# EAGLE design Adafruit Motor Shield v2.3 (EAGLE 6.4)
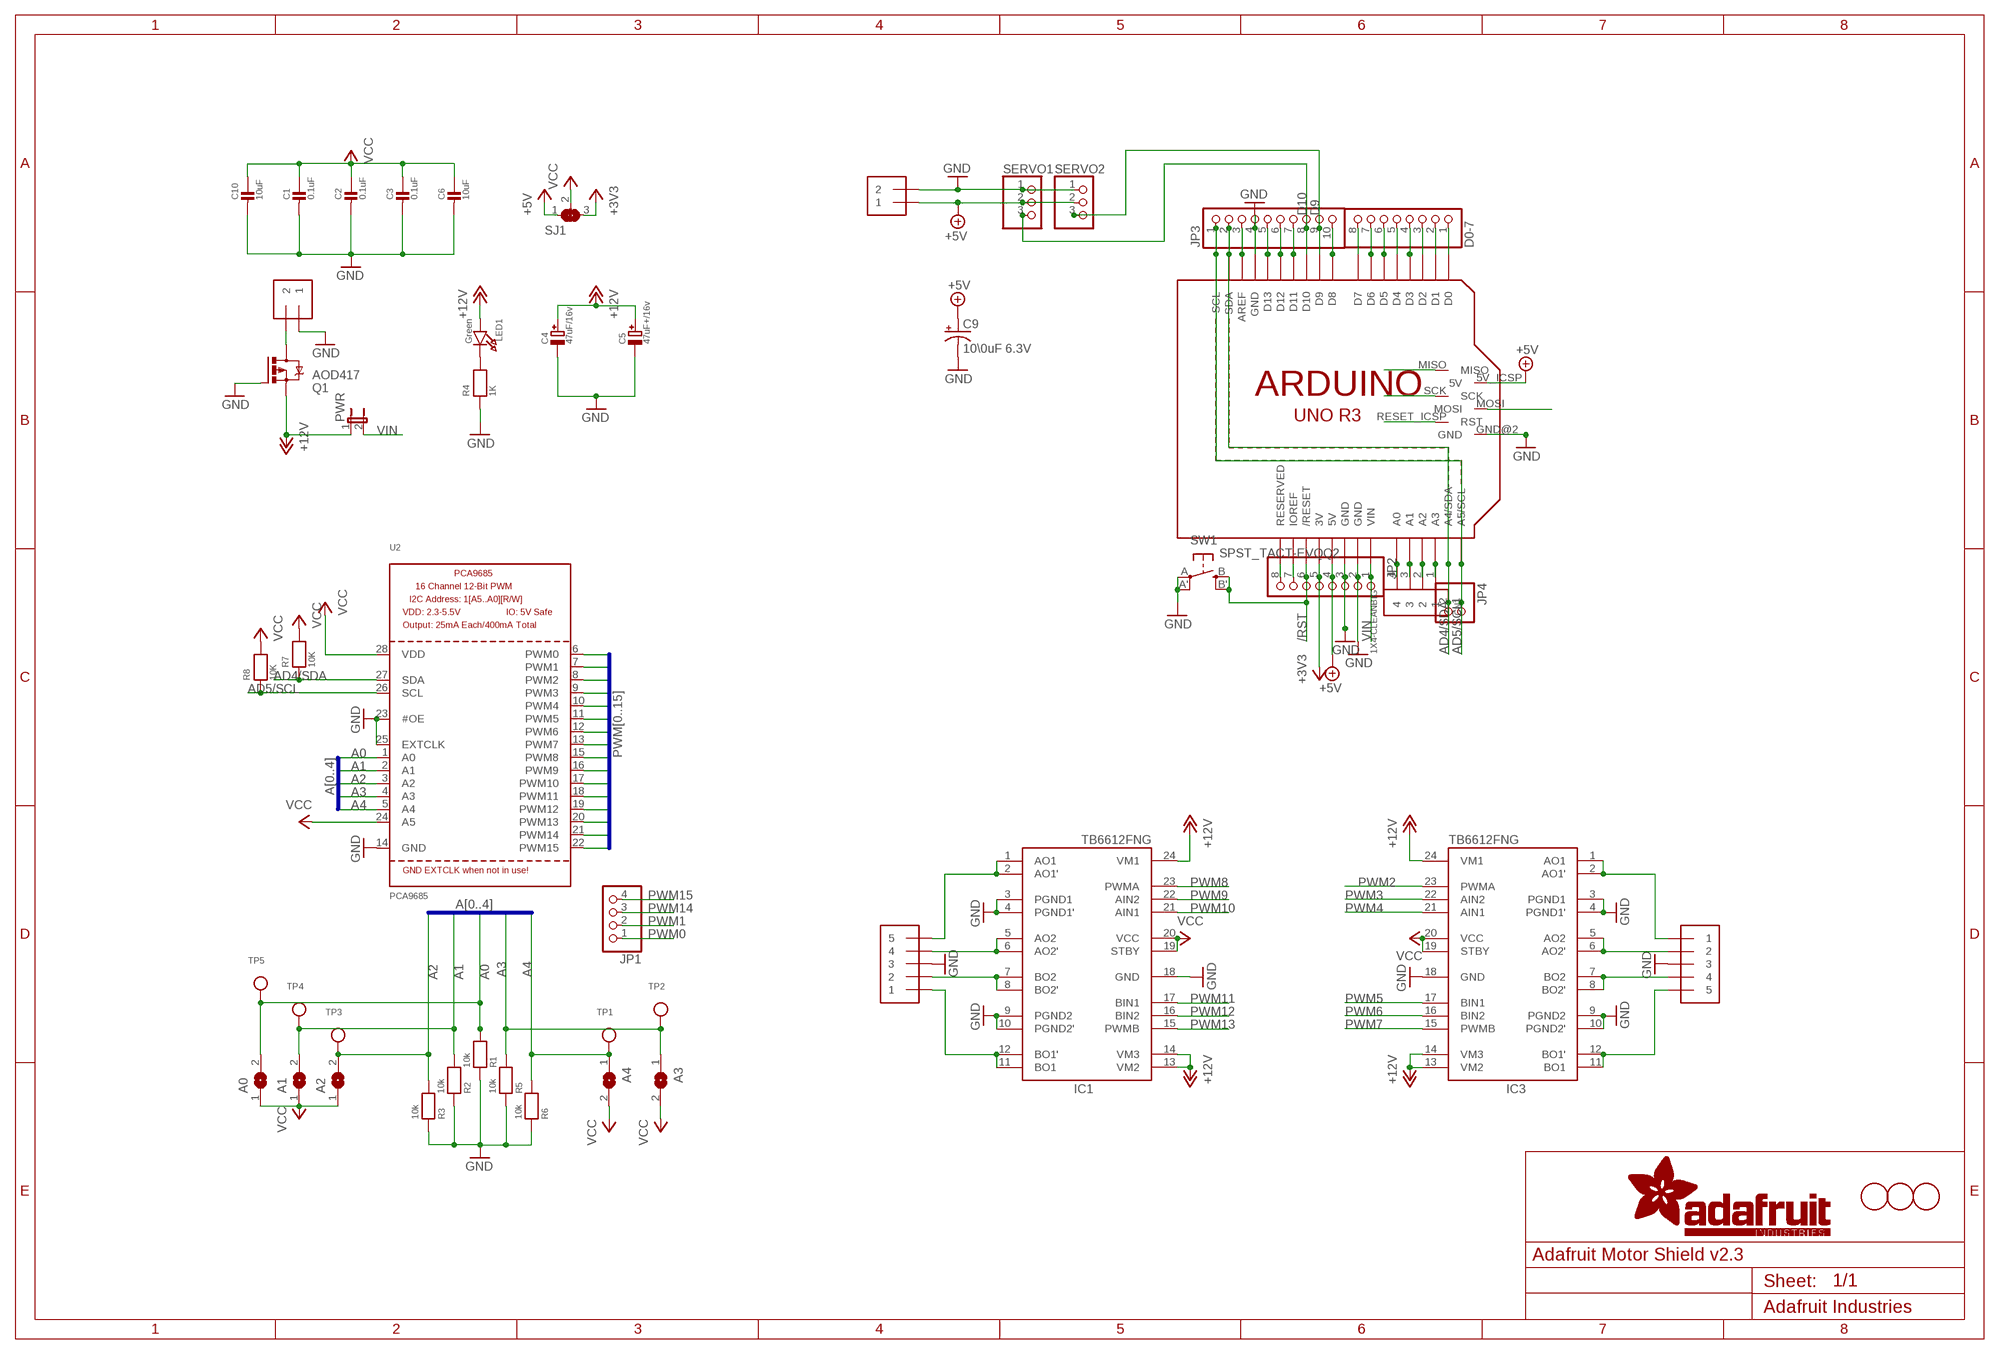
[diagram p0: schematic, sheet 1]

## Parts
A0  SOLDERJUMPERREFLOW_NOPASTE  [SOLDERJUMPER_REFLOW_NOPASTE]
A1  SOLDERJUMPERREFLOW_NOPASTE  [SOLDERJUMPER_REFLOW_NOPASTE]
A2  SOLDERJUMPERREFLOW_NOPASTE  [SOLDERJUMPER_REFLOW_NOPASTE]
A3  SOLDERJUMPERREFLOW_NOPASTE  [SOLDERJUMPER_REFLOW_NOPASTE]
A4  SOLDERJUMPERREFLOW_NOPASTE  [SOLDERJUMPER_REFLOW_NOPASTE]
C1  0.1uF  CAP_CERAMIC0805-NOOUTLINE  [0805-NO]
C2  0.1uF  CAP_CERAMIC0805-NOOUTLINE  [0805-NO]
C3  0.1uF  CAP_CERAMIC0805-NOOUTLINE  [0805-NO]
C4  47uF/16v  CAP_ELECTROLYTICPANASONIC_C  [PANASONIC_C]
C5  47uF+/16v  CAP_ELECTROLYTICPANASONIC_C  [PANASONIC_C]
C6  10uF  CAP_CERAMIC0805-NOOUTLINE  [0805-NO]
C9  10\0uF 6.3V  CPOL-USC  [PANASONIC_C]
C10  10uF  CAP_CERAMIC0805-NOOUTLINE  [0805-NO]
CN1  1X4-CLEANBIG  [1X04-CLEANBIG]
D0-7  PINHD-1X8CLEANBIG  [1X08-CLEANBIG]
IC1  TB6612FNG  [SSOP24]
IC3  TB6612FNG  [SSOP24]
J1  1X5  [1X05-3.5MM]
J2  1X5  [1X05-3.5MM]
JP1  HEADER-1X476MIL  [1X04_ROUND_76]
JP2  PINHD-1X8CLEANBIG  [1X08-CLEANBIG]
JP3  HEADER-1X1070MIL  [1X10_ROUND70]
JP4  HEADER-1X2ROUND  [1X02_ROUND]
LED1  Green  LED0805_NOOUTLINE  [CHIPLED_0805_NOOUTLINE]
MPOWER  1X2-3.5MM  [1X2-3.5MM]
PWR  JP1E  [JP1]
Q1  AOD417  IRFR5305  [D-PAK_TO252AA]
R1  10k  RESISTOR0805_NOOUTLINE  [0805-NO]
R2  10k  RESISTOR0805_NOOUTLINE  [0805-NO]
R3  10k  RESISTOR0805_NOOUTLINE  [0805-NO]
R4  1K  RESISTOR0805_NOOUTLINE  [0805-NO]
R5  10k  RESISTOR0805_NOOUTLINE  [0805-NO]
R6  10k  RESISTOR0805_NOOUTLINE  [0805-NO]
R7  10K  RESISTOR0805_NOOUTLINE  [0805-NO]
R8  10K  RESISTOR0805_NOOUTLINE  [0805-NO]
SERPWR  1X2-3.5MM  [1X2-3.5MM]
SERVO1  PINHD-1X3  [1X03]
SERVO2  PINHD-1X3  [1X03]
SJ1  SOLDERJUMPER_2WAY  [SOLDERJUMPER_2WAY_OPEN_NOPASTE]
SW1  SPST_TACT-EVQQ2  [EVQ-Q2]
TP1  TESTPOINTROUND2MM  [TESTPOINT_ROUND_2MM]
TP2  TESTPOINTROUND2MM  [TESTPOINT_ROUND_2MM]
TP3  TESTPOINTROUND2MM  [TESTPOINT_ROUND_2MM]
TP4  TESTPOINTROUND2MM  [TESTPOINT_ROUND_2MM]
TP5  TESTPOINTROUND2MM  [TESTPOINT_ROUND_2MM]
U2  PCA9685  [TSSOP28]
U$1  ARDUINO_R3_ICSP  [ARDUINOR3_ICSP]
U$2  FIDUCIAL  [FIDUCIAL_1MM]
U$3  FIDUCIAL  [FIDUCIAL_1MM]
U$4  FIDUCIAL  [FIDUCIAL_1MM]

## Nets
+3V3: JP2.5 SJ1.3 U$1.3V
+5V: C9.+ JP2.4 SERPWR.1 SERVO1.2 SERVO2.2 SJ1.1 U$1.5V U$1.5V_ICSP(5V)
+12V: C4.+ C5.+ IC1.13(VM2) IC1.14(VM3) IC1.24(VM1) IC3.13(VM2) IC3.14(VM3) IC3.24(VM1) LED1.A PWR.1 Q1.3(S)
/RST: JP2.6 SW1.B'(S1) SW1.B(S) U$1.RESET(/RESET) U$1.RESET_ICSP(RST)
A0: A0.2 R1.2 TP5.P$1 U2.1(A0)
A1: A1.2 R2.2 TP4.P$1 U2.2(A1)
A2: A2.2 R3.2 TP3.P$1 U2.3(A2)
A3: A3.1 R5.2 TP2.P$1 U2.4(A3)
A4: A4.1 R6.2 TP1.P$1 U2.5(A4)
AD0: CN1.4 U$1.A0
AD1: CN1.3 U$1.A1
AD2: CN1.2 U$1.A2
AD3: CN1.1 U$1.A3
AD4/SDA: JP3.2 JP4.2 R7.1 U2.27(SDA) U$1.A4(A4/SDA) U$1.SDA
AD5/SCL: JP3.1 JP4.1 R8.1 U2.26(SCL) U$1.A5(A5/SCL) U$1.SCL
AREF: JP3.3 U$1.AREF
D0: D0-7.1 U$1.D0
D1: D0-7.2 U$1.D1
D2: D0-7.3 U$1.D2
D3: D0-7.4 U$1.D3
D4: D0-7.5 U$1.D4
D5: D0-7.6 U$1.D5
D6: D0-7.7 U$1.D6
D7: D0-7.8 U$1.D7
D8: JP3.10 U$1.D8
D9: JP3.9 SERVO2.3 U$1.D9
D10: JP3.8 SERVO1.3 U$1.D10
D11: JP3.7 U$1.D11
D12: JP3.6 U$1.D12
D13: JP3.5 U$1.D13
GND: C1.2 C2.2 C3.2 C4.- C5.- C6.2 C9.- C10.2 IC1.3(PGND1) IC1.4(PGND1') IC1.9(PGND2) IC1.10(PGND2') IC1.18(GND) IC3.3(PGND1) IC3.4(PGND1') IC3.9(PGND2) IC3.10(PGND2') IC3.18(GND) J1.3 J2.3 JP2.2 JP2.3 JP3.4 MPOWER.1 Q1.1(G) R1.1 R2.1 R3.1 R4.1 R5.1 R6.1 SERPWR.2 SERVO1.1 SERVO2.1 SW1.A'(P1) SW1.A(P) U2.14(GND) U2.23(#OE) U2.25(EXTCLK) U$1.GND U$1.GND@1(GND) U$1.GND@2(GND) U$1.GND@3(GND)
IOREF: JP2.7 U$1.IOREF
M1A: IC1.1(AO1) IC1.2(AO1') J1.5
M1B: IC1.5(AO2) IC1.6(AO2') J1.4
M2A: IC1.11(BO1) IC1.12(BO1') J1.1
M2B: IC1.7(BO2) IC1.8(BO2') J1.2
M3A: IC3.1(AO1) IC3.2(AO1') J2.1
M3B: IC3.5(AO2) IC3.6(AO2') J2.2
M4A: IC3.11(BO1) IC3.12(BO1') J2.5
M4B: IC3.7(BO2) IC3.8(BO2') J2.4
MISO: U$1.MISO
MOSI: U$1.MOSI
N$2: JP2.8 U$1.RESERVED
N$133: LED1.C R4.2
PWM0: JP1.1 U2.6(PWM0)
PWM1: JP1.2 U2.7(PWM1)
PWM2: IC3.23(PWMA) U2.8(PWM2)
PWM3: IC3.22(AIN2) U2.9(PWM3)
PWM4: IC3.21(AIN1) U2.10(PWM4)
PWM5: IC3.17(BIN1) U2.11(PWM5)
PWM6: IC3.16(BIN2) U2.12(PWM6)
PWM7: IC3.15(PWMB) U2.13(PWM7)
PWM8: IC1.23(PWMA) U2.15(PWM8)
PWM9: IC1.22(AIN2) U2.16(PWM9)
PWM10: IC1.21(AIN1) U2.17(PWM10)
PWM11: IC1.17(BIN1) U2.18(PWM11)
PWM12: IC1.16(BIN2) U2.19(PWM12)
PWM13: IC1.15(PWMB) U2.20(PWM13)
PWM14: JP1.3 U2.21(PWM14)
PWM15: JP1.4 U2.22(PWM15)
SCK: U$1.SCK
VCC: A0.1 A1.1 A2.1 A3.2 A4.2 C1.1 C2.1 C3.1 C6.1 C10.1 IC1.19(STBY) IC1.20(VCC) IC3.19(STBY) IC3.20(VCC) R7.2 R8.2 SJ1.2 U2.24(A5) U2.28(VDD)
VIN: JP2.1 PWR.2 U$1.VIN
VMOTOR: MPOWER.2 Q1.4(D)

## Buses
PWM[0..15]
A[0..4]

## Library data of the parts
A0 A1-A4 = microbuilder:SOLDERJUMPER: SMD Solder JUMPER Solder the two pads together to create a connection, or remove the solder to break it. REFLOW - Use this footprint for solder paste and reflow ovens. WAVE - Use this footprint for hand-soldering (larger pads). CLOSED - Has a trace between the two pads to ensure it is closed by default. The trace needs to be cut to disable the jumper, and can be closed again by creating a solder bridge between the two pads.
C1-C3 C6 C10 = microbuilder:CAP_CERAMIC: Ceramic Capacitors For new designs, use the packages preceded by an '_' character since they are more reliable: The following footprints should be used on most boards: _0402 - Standard footprint for regular board layouts _0603 - Standard footprint for regular board layouts _0805 - Standard footprint for regular board layouts For extremely tight-pitch boards where space is at a premium, the following 'micro-pitch' footprints can be used (smaller pads, no silkscreen outline, etc.): _0402MP - Micro-pitch footprint for very dense/compact boards _0603MP - Micro-pitch footprint for very dense/compact boards _0805MP - Micro-pitch footprint for very dense/compact boards Commonly Stocked Parts 0402 - 0402 Surface Mount Capacitors 16pF 50V 5% [Digikey: 445-4899-2-ND] 18pF 50V 5% [Digikey: 490-1281-2-ND] 22pF 50V 5% [Digikey: 490-1283-2-ND] 68pF 50V 5% [Digikey: 490-1289-2-ND] 0.1uF 10V 10% [Digikey: 490-1318-2-ND] 1.0uF 6.3V 10% [Digikey: 490-1320-2-ND] 0603 - 0603 Surface Mount Capacitors 16 pF 50V 5% [Digikey: 445-5051-2-ND] 22 pF 50V [Digikey: PCC220ACVTR-ND] 33 pF 50V 5% [Digikey: 490-1415-1-ND] 56pF 50V 5% [Digikey: 490-1421-1-ND] 220pF 50V 5% [Digikey: 445-1285-1-ND] 680 pF 50V 2200 pF 50V 5% C0G [Digikey: 445-1297-1-ND] 5600 pF 100V 5% X7R [Digikey: 478-3711-1-ND] 0.1 µF 25V 10% [Digikey: PCC2277TR-ND] 0.22 µF 16V 10% X7R [Digikey: 445-1318-1-ND] 1.0 µF 25V 10% [Digikey: 445-5146-2-ND] 0603 - RF Specific 3pF 250V +/-0.1pF RF [Digikey: 712-1347-1-ND] 18 pF 250V 5% [Digikey: 478-3505-1-ND or 712-1322-1-ND] 56 pF 250V 5% C0G RF [Digikey: 490-4867-1-ND] 68 pF 250V RF [Digikey: 490-4868-1-ND] 0805 - 0805 Surface Mount Capacitors 220 pF 250V 2% RF Ceramic Capacitor [Digikey: 712-1398-1-ND] 1000 pF 50V 2% NP0 Ceramic Capacitor [Digikey: 478-3760-1-ND] 0.1 µF 25V 10% Ceramic Capacitor [Digikey: PCC1828TR-ND] 1.0 µF 16V 10% Ceramic Capacitor[Digikey: 490-1691-2-ND] 10.0 µF 10V 10% Ceramic Capacitor[Digikey: 709-1228-1-ND] 10.0 uF 16V 10% Ceramic Capacitor [Digikey: 478-5165-2-ND] 47 uF 6.3V 20% Ceramic Capacitor [Digikey: 587-1779-1-ND or 399-5506-1-ND] 1206 - 1206 Surface Mount Capacitors 47uF 10V 20% Ceramic Capacitor [Digikey: 490-5528-1-ND or 399-5508-1-ND or 445-6010-1-ND] 100uF 6.3V -20%, +80% Y5V Ceramic Capacitor (Digikey: 490-4512-1-ND, Mouser: 81-GRM31CF50J107ZE1L)
C4 C5 = microbuilder:CAP_ELECTROLYTIC: Electrolytic Capacitors SMT PANASONIC_C - Size C Panasonic Electrolytic Aluminum Capacitor 47µF 16V 20% Electrolytic Capacitor [Digikey: PCE3890TR-ND] PANASONIC_D - Size D Panasonic Electrolytic Aluminum Capacitor 100µF 25V 20% Electrolytic Capacitor [Digikey: PCE3898TR-ND] PTH 3.5 mm grid, 8 mm diameter ... 3.5 mm grid, 10 mm diameter ...
C9 = adafruit:CPOL-US: POLARIZED CAPACITOR, American symbol
CN1 = adafruit:1X4: 4-pin connector
D0-7 JP2 = adafruit:PINHD-1X8: PIN HEADER
IC1 IC3 = adafruit:TB6612FNG: TB6612FNG MOS dual H-bridge motor driver, 1.2A current 3.2A peak 3 or 5v logic and 3-15v motor
J1 J2 = adafruit:1X5
JP1 = microbuilder:HEADER-1X4: PIN HEADER
JP3 = microbuilder:HEADER-1X10: PIN HEADER
JP4 = microbuilder:HEADER-1X2: PIN HEADER
LED1 = microbuilder:LED: LED 0603 - 0603 Surface Mount Package 2mA: Green LED - Low Power (3.9mcd, 2ma, 1.7Vf) - Digikey: 475-2709-2-ND Orange LED - Low Power (9.8mcd, 2ma, 1.8Vf) - Digikey: 475-1194-2-ND Red LED - Low Power (5mcd, 2ma, 1.8Vf) - Digikey: 475-1195-2-ND Yellow LED - Low Power (7mcd, 2ma, 1.8Vf) - Digikey: 475-1196-2-ND 5mA: Blue LED - Low Power (17mcd, 5ma, 2.9Vf) - Digikey: LNJ937W8CRACT-ND 0805 - 0805 Surface Mount Package 2mA: Red LED (8.8mcd, 2mA, 1.8Vf, Clear) - Low Power [Digikey: 475-2510-1-ND] Green LED (5mcd, 2mA, 1.8Vf, Clear) - Low Power [Digikey: 475-2730-1-ND] Yellow LED (11.3mcd, 2mA, 1.8Vf, Clear) - Low Power [Digikey: 475-2555-1-ND] 20mA: Red LED (104mcd, 20mA, Diffused) - LS R976 [Digikey: 475-1278-6-ND] Red LED (12mcd, 20mA, 2.0Vf, Clear) - APT2012EC [Digikey: 754-1128-1-ND] Green LED (15mcd, 20mA, 2.2Vf, Clear) - APT2012GC [Digikey: 754-1131-1-ND] Orange LED (160mcd, 20mA, 2.1Vf, Clear) - APT2012SECK [Digikey: 754-1130-1-ND] 1206 - 1206 Surface Mount Package Green LED (26mcd, 20mA, Diffused) - LG N971 [Digikey: 475-1407-6-ND] Red LED (15mcd, 20mA, Diffused) - LH N974 [Digikey: 475-1416-6-ND] Cree - Cree High-Power Surface Mount LEDs XPEBWT-L1-0000-00D50 - White 111lm 350mA 2.9Vf 6200K 110° XTEAWT-00-0000-00000LEE3 - White 114lm 350mA 2.85Vf 5000K 115° Everlight - Everlight 45-21 Series Surface Mount LEDs 45-21/QK2C-B2832AC2CB2/2T - Warm White 2000mcd 20mA 3.25Vf 3050K 120° 45-21/LK2C-B38452C4CB2/2T - Nuetral White 2000mcd 20mA 3.25Vf 4150K 120° 45-21/LK2C-B50634C6CB2/2T - Cold White 2200mcd 20mA 3.25Vf 5650K 120° PLCC2 Reverse Mount LS T77K-J1L2-1-0-2-R18-Z - Red 11.25mcd 2mA 1.8Vf 630nm 120° LO T77K-L1M2-24-Z - Orange 19.6mcd 2mA 1.8Vf 606nm 120° LY T77K-K2M1-26-Z - Yellow 15.7mcd 2mA 1.8Vf 587nm 120°
MPOWER SERPWR = adafruit:1X2: 3.5mm Terminal block http://www.ladyada.net/library/pcb/eaglelibrary.html
PWR = jumper:JP1E: JUMPER
Q1 = transistor-power:IRF?5305: HEXFET Power MOSFET Source: http://www.irf.com/product-info/datasheets/data/irfr5305pbf.pdf
R1-R8 = microbuilder:RESISTOR: Resistors For new designs, use the packages preceded by an '_' character since they are more reliable: The following footprints should be used on most boards: _0402 - Standard footprint for regular board layouts _0603 - Standard footprint for regular board layouts _0805 - Standard footprint for regular board layouts For extremely tight-pitch boards where space is at a premium, the following 'micro-pitch' footprints can be used (smaller pads, no silkscreen outline, etc.): _0402MP - Micro-pitch footprint for very dense/compact boards _0603MP - Micro-pitch footprint for very dense/compact boards _0805MP - Micro-pitch footprint for very dense/compact boards
SERVO1 SERVO2 = adafruit:PINHD-1X3: PIN HEADER
SJ1 = microbuilder:SOLDERJUMPER_2WAY: 2-Way Solder Jumper
SW1 = adafruit:SPST_TACT: SMT 6mm switch, EVQQ2 series http://www.ladyada.net/library/eagle
TP1-TP5 = microbuilder:TESTPOINT: Test Point Various test points for characterisation and PCB testing TESTPOINT_SMT - Compact Surface Mount Test Point [Digikey: 5016KTR-ND]
U2 = microbuilder:PCA9685: PCA9685 - 16 Channel 12-Bit I2C PWM Controller 5.0V tolerant 16 channel, 12-bit I2C PWM controller with 25mA per output (max. 400mA total) Digikey: 568-5931-1-ND
U$1 = adafruit:ARDUINO_R3_ICSP
U$2-U$4 = adafruit:FIDUCIAL: For use by pick and place machines to calibrate the vision/machine, 1mm By microbuilder.eu

## Board
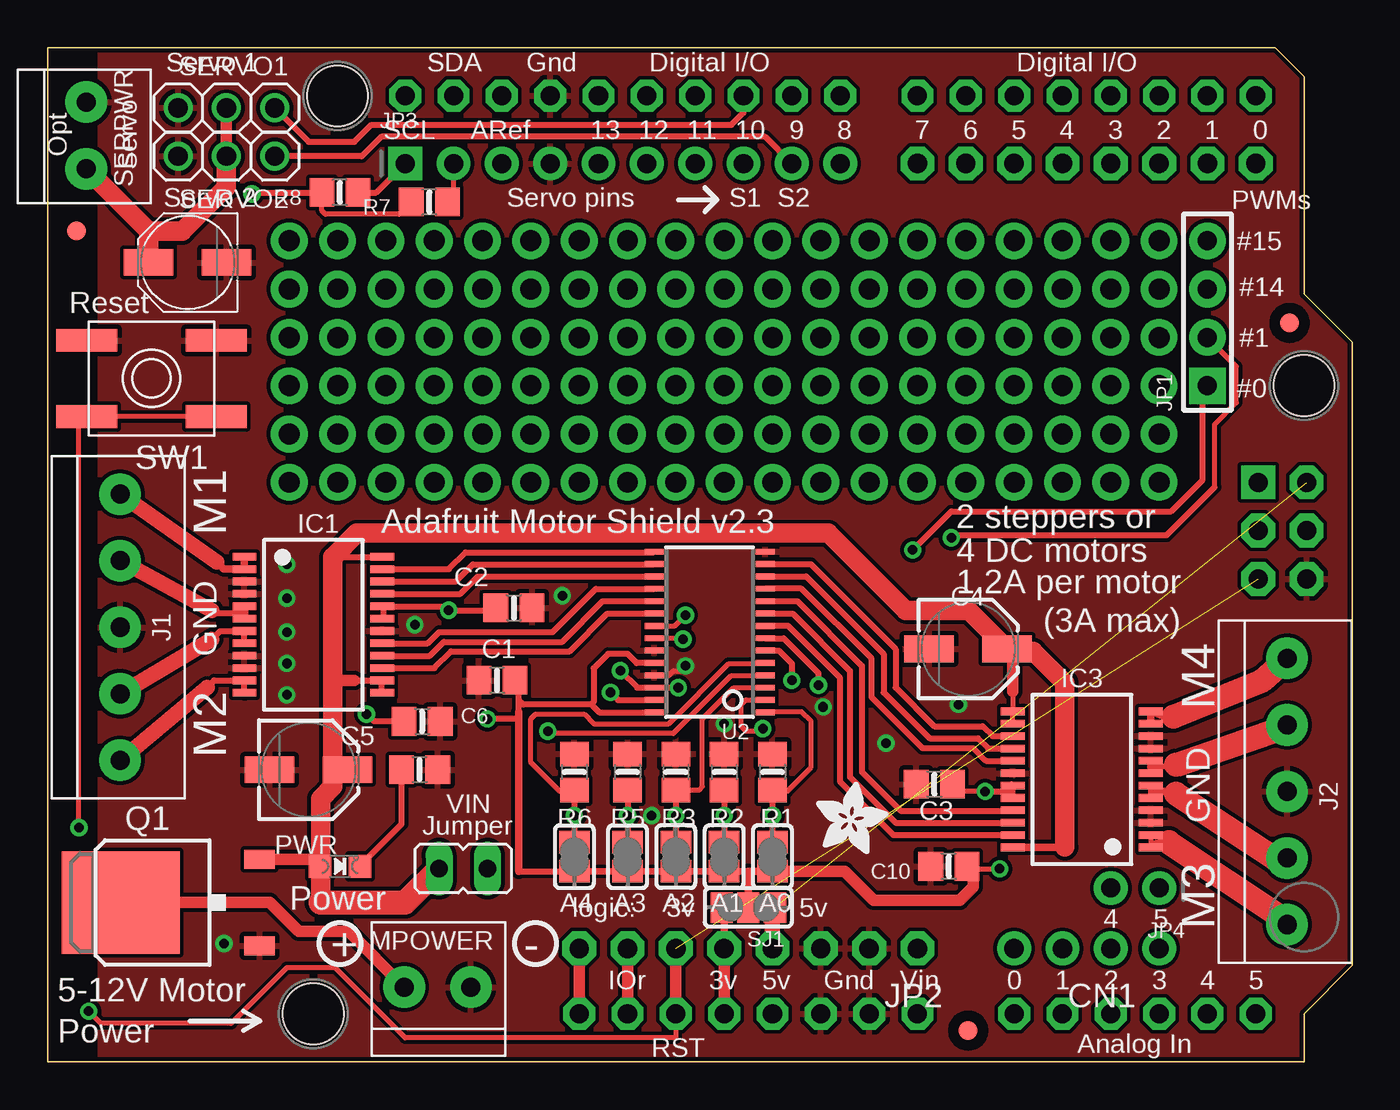
[diagram p1: board, top side]
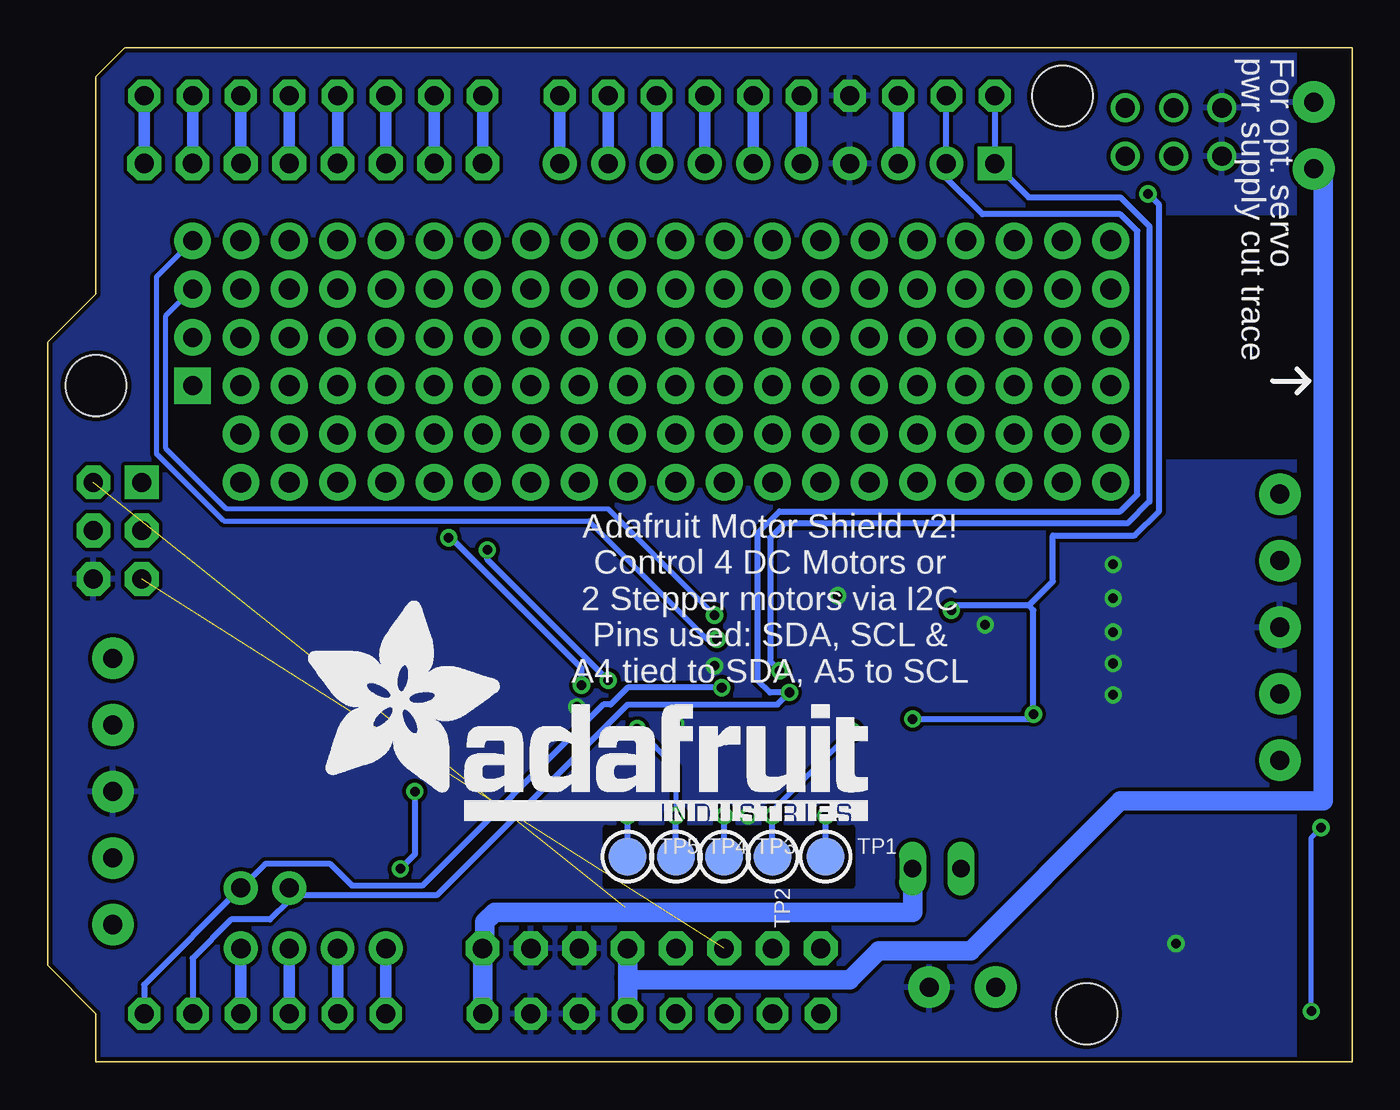
[diagram p2: board, bottom side, seen from below]

Size 68.58 x 53.34 mm. Coordinates in mm from the lower left corner, seen from the top.
Outline: 0,0 0,53.34 64.52,53.34 66.04,51.82 66.04,40.39 68.58,37.85 68.58,5.08 66.04,2.54 66.04,0 0,0
Copper layers (1*16): Top 0.035mm / dielectric 1.5mm / Bottom 0.035mm
Design rules "pcbcart *": minimum track width 10mil, minimum drill 16mil, track to track 8mil, track to pad 8mil, pad to pad 8mil, via to via 8mil, smd to smd 8mil, copper to edge 10mil, drill to drill 8mil, minimum pad ring 10mil, minimum via ring 8mil, stop-mask expansion 4mil, vias tented up to drill 20mil, thermal gap 10mil
Holes 3.2 mm at 15.24,50.8 66.04,35.56 13.97,2.54
bRestrict: area 26.3,9.3 to 39.2,12.3

### Footprints (pad centres in the part's own frame; a part is rotated, then mirrored left to right if it is on the bottom)
SOLDERJUMPER_REFLOW_NOPASTE = smd 1.168 x 1.6: 1 -0.762,0; 2 0.762,0
0805-NO = smd 1.3 x 1.5: 1 -0.95,0; 2 0.95,0
PANASONIC_C = smd 2.6 x 1.4: + 2.05,0; - -2.05,0
1X04-CLEANBIG = drill 1.016 pad 1.778: 1 -3.81,0; 2 -1.27,0; 3 1.27,0; 4 3.81,0
1X08-CLEANBIG = drill 1.016 pad 1.778 octagon: 1 -8.89,0; 2 -6.35,0; 3 -3.81,0; 4 -1.27,0; 5 1.27,0; 6 3.81,0; 7 6.35,0; 8 8.89,0
SSOP24 = smd 0.4 x 1.25: 1 -3.575,-3.625; 2 -2.925,-3.625; 3 -2.275,-3.625; 4 -1.625,-3.625; 5 -0.975,-3.625; 6 -0.325,-3.625; 7 0.325,-3.625; 8 0.975,-3.625; 9 1.625,-3.625; 10 2.275,-3.625; 11 2.925,-3.625; 12 3.575,-3.625; 13 3.575,3.625; 14 2.925,3.625; 15 2.275,3.625; 16 1.625,3.625; 17 0.975,3.625; 18 0.325,3.625; 19 -0.325,3.625; 20 -0.975,3.625; 21 -1.625,3.625; 22 -2.275,3.625; 23 -2.925,3.625; 24 -3.575,3.625
1X05-3.5MM = drill 1 pad 2.184: 1 7,0; 2 3.5,0; 3 0,0; 4 -3.5,0; 5 -7,0
1X04_ROUND_76 = drill 1 pad 1.93 square: 1 -3.81,0 | drill 1 pad 1.93: 2 -1.27,0; 3 1.27,0; 4 3.81,0
1X10_ROUND70 = drill 1 pad 1.778 square: 1 -11.43,0 | drill 1 pad 1.778: 2 -8.89,0; 3 -6.35,0; 4 -3.81,0; 5 -1.27,0; 6 1.27,0; 7 3.81,0; 8 6.35,0; 9 8.89,0; 10 11.43,0
1X02_ROUND = drill 1 pad 1.778: 1 -1.27,0; 2 1.27,0
CHIPLED_0805_NOOUTLINE = smd 1.2 x 1.2: A 0,-1.05; C 0,1.05
1X2-3.5MM = drill 1 pad 2.184: 1 1.8,0; 2 -1.7,0
JP1 = drill 0.914 long: 1 0,-1.27; 2 0,1.27
D-PAK_TO252AA = smd 1 x 1.6: 1 -2.28,-4.8; 3 2.28,-4.8 | smd 5.4 x 6.2: 4 0,2.5
1X03 = drill 1.016: 1 -2.54,0; 2 0,0; 3 2.54,0
SOLDERJUMPER_2WAY_OPEN_NOPASTE = smd 1.168 x 1.6: 1 -1.397,0; 2 0,0; 3 1.397,0
EVQ-Q2 = smd 3.2 x 1.2: A -3.4,-2; A' 3.4,-2; B -3.4,2; B' 3.4,2
TESTPOINT_ROUND_2MM = smd 2 x 2: P$1 0,0
TSSOP28 = smd 0.305 x 0.991: 1 -4.225,-2.918; 2 -3.575,-2.918; 3 -2.925,-2.918; 4 -2.275,-2.918; 5 -1.625,-2.918; 6 -0.975,-2.918; 7 -0.325,-2.918; 8 0.325,-2.918; 9 0.975,-2.918; 10 1.625,-2.918; 11 2.275,-2.918; 12 2.925,-2.918; 13 3.575,-2.918; 14 4.225,-2.918; 15 4.225,2.918; 16 3.575,2.918; 17 2.925,2.918; 18 2.275,2.918; 19 1.625,2.918; 20 0.975,2.918; 21 0.325,2.918; 22 -0.325,2.918; 23 -0.975,2.918; 24 -1.625,2.918; 25 -2.275,2.918; 26 -2.925,2.918; 27 -3.575,2.918; 28 -4.225,2.918
ARDUINOR3_ICSP = drill 1 pad 1.676 octagon: 3V 35.56,2.54; 5V 38.1,2.54; A0 50.8,2.54; A1 53.34,2.54; A2 55.88,2.54; A3 58.42,2.54; A4 60.96,2.54; A5 63.5,2.54; AREF 23.876,50.8; D0 63.5,50.8; D1 60.96,50.8; D2 58.42,50.8; D3 55.88,50.8; D4 53.34,50.8; D5 50.8,50.8; D6 48.26,50.8; D7 45.72,50.8; D8 41.656,50.8; D9 39.116,50.8; D10 36.576,50.8; D11 34.036,50.8; D12 31.496,50.8; D13 28.956,50.8; GND 26.416,50.8; GND@1 43.18,2.54; GND@2 40.64,2.54; IOREF 30.48,2.54; RESERVED 27.94,2.54; RESET 33.02,2.54; SCL 18.796,50.8; SDA 21.336,50.8; VIN 45.72,2.54 | drill 1 pad 1.778 octagon: 5V_ICSP 66.167,30.48; GND@3 66.167,25.4; MOSI 66.167,27.94; RESET_ICSP 63.627,25.4; SCK 63.627,27.94 | drill 1 pad 1.778 square: MISO 63.627,30.48
FIDUCIAL_1MM = smd 1 x 1: 1 0,0

### Placement (x,y rotation side)
A0  38.1,10.79 90 top
A1  35.56,10.79 90 top
A2  33.02,10.79 90 top
A3  30.48,10.79 270 top
A4  27.69,10.79 270 top
C1  23.62,20.07 180 top
C2  24.51,23.88 0 top
C3  46.61,14.61 180 top
C4  48.39,21.72 0 top
C5  13.72,15.37 0 top
C6  19.68,17.91 0 top
C9  7.37,42.04 180 top
C10  47.37,10.29 180 top
CN1  54.61,5.97 180 top
D0-7  54.61,47.24 180 top
IC1  13.97,22.99 270 top
IC3  54.36,14.86 90 top
J1  3.81,22.86 270 top
J2  65.15,14.22 270 top
JP1  60.96,39.37 90 top
JP2  36.83,5.97 180 top
JP3  30.23,47.24 0 top
JP4  57.15,9.14 180 top
LED1  15.37,10.29 270 top
MPOWER  20.45,3.94 0 top
PWR  21.84,10.16 270 top
Q1  6.35,8.38 90 top
R1  38.1,15.24 270 top
R2  35.56,15.24 270 top
R3  33.02,15.24 270 top
R4  19.56,15.37 180 top
R5  30.48,15.24 270 top
R6  27.69,15.24 270 top
R7  20.07,45.21 180 top
R8  15.37,45.72 180 top
SERPWR  2.03,48.77 270 top
SERVO1  9.4,50.16 0 top
SERVO2  9.4,47.62 0 top
SJ1  36.83,8.13 180 top
SW1  5.46,35.94 180 top
TP1  27.69,10.79 0 bottom
TP2  30.48,10.79 270 bottom
TP3  33.02,10.79 0 bottom
TP4  35.56,10.79 0 bottom
TP5  38.1,10.79 0 bottom
U2  34.8,22.61 90 top
U$1  0,0 0 top
U$2  48.39,1.65 0 top
U$3  1.52,43.69 0 top
U$4  65.28,38.86 0 top
U$5  [ADAFRUIT_TEXT_30MM]  55.12,12.7 0 bottom
U$6  [ADAFRUIT_3.5MM]  40.39,10.92 0 top

### Tracks (layer width: path | path; a pad name or v marks a point on that pad's centre or on a via)
+3V3
  Top 0.406: JP2.5 35.56,8 SJ1.3
  Top 0.61: U$1.3V JP2.5
+5V  (1 unrouted)
  Top 0.254: SJ1.1 36.7,8.13
  Top 0.406: 38.1,8 SJ1.1
  Top 0.61: SERVO2.2 SERVO1.2
  Top 0.813: 38.1,8 JP2.4
  Top 1.016: SERVO2.2 9.4,45.99 7.09,43.68 5.32,43.68 | C9.+ 5.32,43.68 | 5.32,43.68 SERPWR.1
  Bottom 0.813: 38.1,4.45 37.85,4.45 37.85,4.32
  Bottom 1.016: 37.85,4.32 26.42,4.32 24.89,5.84 20.07,5.84 12.19,13.72 1.52,13.72 1.52,46.46 SERPWR.1 | JP2.4 38.1,4.45 U$1.5V
+12V
  Top 0.254: 50.73,19.49 IC3.13 IC3.14
  Top 0.305: 16.13,20.07 IC1.14 17.53,19.99 17.53,19.43 17.58,19.43 IC1.13 | 14.99,15.88 14.73,15.62 14.99,15.37 C5.+ | 14.99,26.54 15.01,26.56 IC1.24 | 53.47,11.3 53.45,11.28 53.32,11.28
  Top 0.406: IC3.24 53.32,11.28
  Top 0.61: 14.99,20.07 16.13,20.07 | 50.73,19.49 50.73,21.42 C4.+ | Q1.3 14.35,10.66 14.35,10.79
  Top 1.016: 14.99,26.54 14.99,20.07 14.99,15.88 14.99,14.48 14.35,13.84 14.35,10.79 14.35,10.29 LED1.A 14.35,10.25 14.35,8.38 | 15.01,26.56 16.26,27.81 41.04,27.81 45.1,23.75 48.41,23.75 C4.+ 50.56,21.59 51.82,21.59 53.47,19.94 53.47,11.3
  Top 1.27: 14.35,8.38 18.8,8.38 PWR.1
/RST  (via drill 0.5)  (1 unrouted)
  Top 0.254: SW1.B SW1.B' 1.65,33.53 v1.65,12.32 | U$1.RESET 33.02,1.27 18.8,1.27 15.11,4.95 12.57,4.95 9.65,2.03 2.79,2.03 v2.16,2.67
  Top 0.61: JP2.6 U$1.RESET
  Bottom 0.254: v2.16,2.67 2.16,11.81 v1.65,12.32
A0  (via drill 0.5)
  Top 0.254: U2.1 37.75,18.41 39.62,18.41 40.13,17.91 40.13,15.49 38.88,14.24 38.83,14.29 R1.2
  Top 0.305: R1.2 v38.1,12.95 A0.2
  Bottom 0.305: TP5.P$1 v38.1,12.95
A1  (via drill 0.5)
  Top 0.254: U2.2 37.7,19.05 36.7,19.05 36.45,18.8 36.45,17.65 36.7,17.4 37.47,17.4 v37.59,17.53 | 35.61,14.29 R2.2
  Top 0.305: R2.2 v35.56,12.95 A1.2
  Bottom 0.254: v37.59,17.53 35.56,15.49 v35.56,12.95
  Bottom 0.305: TP4.P$1 v35.56,12.95
A2  (via drill 0.5)
  Top 0.254: U2.3 36.06,19.68 34.42,18.03 34.42,14.48 34.23,14.29 R3.2
  Top 0.305: R3.2 v33.02,12.95 A2.2
  Bottom 0.305: TP3.P$1 v33.02,12.95
A3  (via drill 0.5)
  Top 0.254: U2.4 37.7,20.32 35.94,20.32 32.89,17.27 26.42,17.27 v26.29,17.4 | 30.3,14.29 R5.2
  Top 0.305: R5.2 v30.48,12.95 A3.1
  Bottom 0.254: v30.48,12.95 30.48,13.21 v26.29,17.4
  Bottom 0.305: TP2.P$1 v30.48,12.95
A4  (via drill 0.5)
  Top 0.254: U2.5 37.69,20.95 35.81,20.95 32.64,17.78 28.7,17.78 28.19,18.29 25.65,18.29 25.4,18.03 25.4,15.75 26.91,14.24 27.69,14.24 R6.2
  Top 0.305: R6.2 v27.69,12.95 A4.1
  Bottom 0.305: TP1.P$1 v27.69,12.95
AD0
  Bottom 0.61: CN1.4 U$1.A0
AD1
  Bottom 0.61: CN1.3 U$1.A1
AD2
  Bottom 0.61: CN1.2 U$1.A2
AD3
  Bottom 0.61: CN1.1 U$1.A3
AD4/SDA  (via drill 0.5)
  Top 0.254: R7.1 21.34,45.53 JP3.2
  Top 0.305: 31.9,19.05 U2.27 29.99,19.03 v29.59,19.43 | 21.34,46.86 JP3.2
  Bottom 0.305: 21.34,47.12 21.34,46.48 19.43,44.58 12.19,44.58 11.3,43.69 11.3,29.84 12.19,28.96 30.1,28.96 31.24,27.81 31.24,20.07 30.61,19.43 v29.59,19.43 30.23,18.8 38.1,18.8 48.13,8.76 55.5,8.76 JP4.2 55.88,8.51 56.9,7.49 58.93,7.49 60.96,5.46 U$1.A4 | JP3.2 U$1.SDA
  Bottom 0.61: JP3.2 21.34,47.12
AD5/SCL  (via drill 0.5)
  Top 0.305: v30.1,20.57 30.99,19.68 U2.26 v33.14,19.68 v33.15,19.68 | R8.1 17.27,45.72 JP3.1
  Bottom 0.305: U$1.SCL JP3.1 | 18.41,46.86 17.02,45.47 12.19,45.47 10.67,43.94 10.67,29.46 11.81,28.32 29.84,28.32 30.61,27.56 30.61,21.08 v30.1,20.57 | v33.15,19.68 38.1,19.68 38.99,18.8 39.37,18.8 48.9,9.27 52.58,9.27 53.72,10.41 57.15,10.41 JP4.1 63.5,4.06 U$1.A5
  Bottom 0.61: 18.41,46.86 JP3.1
AREF
  Bottom 0.61: U$1.AREF JP3.3
D0
  Bottom 0.61: U$1.D0 D0-7.1
D1
  Bottom 0.61: U$1.D1 D0-7.2
D2
  Bottom 0.61: U$1.D2 D0-7.3
D3
  Bottom 0.61: U$1.D3 D0-7.4
D4
  Bottom 0.61: U$1.D4 D0-7.5
D5
  Bottom 0.305: 50.8,48.13 50.93,48.01 50.93,47.37 D0-7.6
  Bottom 0.61: U$1.D5 50.8,48.13
D6
  Bottom 0.61: U$1.D6 D0-7.7
D7
  Bottom 0.61: U$1.D7 D0-7.8
D8
  Bottom 0.61: U$1.D8 JP3.10
D9
  Top 0.305: JP3.9 37.72,48.64 17.53,48.64 16.51,47.62 SERVO2.3
  Bottom 0.61: JP3.9 U$1.D9
D10
  Top 0.305: SERVO1.3 13.72,48.39 16.13,48.39 17.02,49.28 35.94,49.28 36.58,49.91 U$1.D10
  Bottom 0.61: JP3.8 U$1.D10
D11
  Bottom 0.61: JP3.7 U$1.D11
D12
  Bottom 0.61: JP3.6 U$1.D12
D13
  Bottom 0.61: JP3.5 U$1.D13
GND  (via drill 0.5)
  Top 0.254: U2.25 32.65,20.33 32.89,20.57 33.27,20.57 v33.53,20.83
  other vias: 19.3,22.99 12.57,24.38 12.57,22.61 12.57,20.95 12.57,19.3 12.57,26.16 27.05,24.51 35.56,17.78 31.75,12.95 47.88,18.8 44.07,16.76 40.77,18.67 9.27,6.22
  pour Bottom: 3.05,-0.13 3.05,53.47 71.25,53.59 71.25,0
  pour Top: 2.79,0.13 2.79,53.72 70.74,53.72 70.74,0.13
IOREF
  Top 0.61: U$1.IOREF JP2.7
M1A
  Top 0.305: 10.41,25.91 IC1.2
  Top 0.406: 10.41,26.56 IC1.1 IC1.2 9.27,25.91 8.89,26.29
  Top 0.813: J1.5 8.89,26.29
M1B
  Top 0.305: 8.64,23.75 8.76,23.62 10.29,23.62 10.29,23.37 IC1.6 10.4,23.37 10.41,23.37 10.41,23.88 10.41,23.89 IC1.5
  Top 0.813: J1.4 8.64,23.75
M2A
  Top 0.305: 8.38,19.68 8.76,20.06 IC1.11 10.35,19.5 10.41,19.43
  Top 0.406: 10.41,19.43 10.39,19.41 IC1.12
  Top 0.813: J1.1 8.38,19.68
M2B
  Top 0.305: IC1.8 10.29,22.07 10.35,22.13 IC1.7 9.07,22.66 8.64,22.23
  Top 0.813: J1.2 8.64,22.23
M3A
  Top 0.254: IC3.2 IC3.1 58.25,11.56 58.93,11.56
  Top 1.27: 58.93,11.56 65.02,7.49 J2.1
M3B
  Top 0.254: IC3.5 IC3.6
  Top 0.406: IC3.5 58.32,14.22 58.93,14.22 59.31,14.1
  Top 1.27: 59.31,14.1 64.46,10.72 J2.2
M4A
  Top 0.406: IC3.11 IC3.12 58.63,18.16 59.18,18.16
  Top 1.27: 59.18,18.16 63.87,20.07 J2.5
M4B
  Top 0.305: IC3.7 IC3.8 57.94,15.49 59.31,15.62
  Top 1.27: 59.31,15.62 64.83,17.53 J2.4
N$2
  Top 0.61: U$1.RESERVED JP2.8
N$34  (via drill 1.1 pad 1.93)
  other vias: 12.7,33.02
N$35  (via drill 1.1 pad 1.93)
  other vias: 15.24,33.02
N$36  (via drill 1.1 pad 1.93)
  other vias: 15.24,35.56
N$37  (via drill 1.1 pad 1.93)
  other vias: 15.24,38.1
N$38  (via drill 1.1 pad 1.93)
  other vias: 12.7,38.1
N$39  (via drill 1.1 pad 1.93)
  other vias: 12.7,40.64
N$40  (via drill 1.1 pad 1.93)
  other vias: 15.24,40.64
N$41  (via drill 1.1 pad 1.93)
  other vias: 15.24,43.18
N$42  (via drill 1.1 pad 1.93)
  other vias: 12.7,43.18
N$43  (via drill 1.1 pad 1.93)
  other vias: 17.78,43.18
N$44  (via drill 1.1 pad 1.93)
  other vias: 12.7,35.56
N$45  (via drill 1.1 pad 1.93)
  other vias: 17.78,40.64
N$46  (via drill 1.1 pad 1.93)
  other vias: 17.78,38.1
N$47  (via drill 1.1 pad 1.93)
  other vias: 17.78,35.56
N$48  (via drill 1.1 pad 1.93)
  other vias: 17.78,33.02
N$49  (via drill 1.1 pad 1.93)
  other vias: 20.32,33.02
N$50  (via drill 1.1 pad 1.93)
  other vias: 20.32,35.56
N$51  (via drill 1.1 pad 1.93)
  other vias: 20.32,38.1
N$52  (via drill 1.1 pad 1.93)
  other vias: 20.32,40.64
N$53  (via drill 1.1 pad 1.93)
  other vias: 20.32,43.18
N$54  (via drill 1.1 pad 1.93)
  other vias: 22.86,43.18
N$55  (via drill 1.1 pad 1.93)
  other vias: 22.86,40.64
N$56  (via drill 1.1 pad 1.93)
  other vias: 22.86,38.1
N$57  (via drill 1.1 pad 1.93)
  other vias: 22.86,35.56
N$58  (via drill 1.1 pad 1.93)
  other vias: 22.86,33.02
N$59  (via drill 1.1 pad 1.93)
  other vias: 25.4,33.02
N$60  (via drill 1.1 pad 1.93)
  other vias: 25.4,35.56
N$61  (via drill 1.1 pad 1.93)
  other vias: 25.4,38.1
N$62  (via drill 1.1 pad 1.93)
  other vias: 25.4,40.64
N$63  (via drill 1.1 pad 1.93)
  other vias: 25.4,43.18
N$64  (via drill 1.1 pad 1.93)
  other vias: 27.94,43.18
N$65  (via drill 1.1 pad 1.93)
  other vias: 27.94,40.64
N$66  (via drill 1.1 pad 1.93)
  other vias: 27.94,38.1
N$67  (via drill 1.1 pad 1.93)
  other vias: 27.94,35.56
N$68  (via drill 1.1 pad 1.93)
  other vias: 27.94,33.02
N$69  (via drill 1.1 pad 1.93)
  other vias: 30.48,33.02
N$70  (via drill 1.1 pad 1.93)
  other vias: 30.48,35.56
N$71  (via drill 1.1 pad 1.93)
  other vias: 30.48,38.1
N$72  (via drill 1.1 pad 1.93)
  other vias: 30.48,40.64
N$73  (via drill 1.1 pad 1.93)
  other vias: 30.48,43.18
N$74  (via drill 1.1 pad 1.93)
  other vias: 33.02,43.18
N$75  (via drill 1.1 pad 1.93)
  other vias: 35.56,43.18
N$76  (via drill 1.1 pad 1.93)
  other vias: 38.1,43.18
N$77  (via drill 1.1 pad 1.93)
  other vias: 40.64,43.18
N$78  (via drill 1.1 pad 1.93)
  other vias: 43.18,43.18
N$79  (via drill 1.1 pad 1.93)
  other vias: 45.72,43.18
N$80  (via drill 1.1 pad 1.93)
  other vias: 48.26,43.18
N$81  (via drill 1.1 pad 1.93)
  other vias: 50.8,40.64
N$82  (via drill 1.1 pad 1.93)
  other vias: 53.34,40.64
N$83  (via drill 1.1 pad 1.93)
  other vias: 55.88,40.64
N$84  (via drill 1.1 pad 1.93)
  other vias: 58.42,40.64
N$89  (via drill 1.1 pad 1.93)
  other vias: 58.42,33.02
N$90  (via drill 1.1 pad 1.93)
  other vias: 58.42,35.56
N$91  (via drill 1.1 pad 1.93)
  other vias: 58.42,38.1
N$92  (via drill 1.1 pad 1.93)
  other vias: 55.88,38.1
N$93  (via drill 1.1 pad 1.93)
  other vias: 55.88,35.56
N$94  (via drill 1.1 pad 1.93)
  other vias: 55.88,33.02
N$95  (via drill 1.1 pad 1.93)
  other vias: 53.34,33.02
N$96  (via drill 1.1 pad 1.93)
  other vias: 53.34,35.56
N$97  (via drill 1.1 pad 1.93)
  other vias: 53.34,38.1
N$98  (via drill 1.1 pad 1.93)
  other vias: 50.8,38.1
N$99  (via drill 1.1 pad 1.93)
  other vias: 50.8,35.56
N$100  (via drill 1.1 pad 1.93)
  other vias: 50.8,33.02
N$101  (via drill 1.1 pad 1.93)
  other vias: 48.26,33.02
N$102  (via drill 1.1 pad 1.93)
  other vias: 48.26,35.56
N$103  (via drill 1.1 pad 1.93)
  other vias: 48.26,38.1
N$104  (via drill 1.1 pad 1.93)
  other vias: 48.26,40.64
N$105  (via drill 1.1 pad 1.93)
  other vias: 45.72,40.64
N$106  (via drill 1.1 pad 1.93)
  other vias: 45.72,38.1
N$107  (via drill 1.1 pad 1.93)
  other vias: 45.72,35.56
N$108  (via drill 1.1 pad 1.93)
  other vias: 45.72,33.02
N$109  (via drill 1.1 pad 1.93)
  other vias: 43.18,33.02
N$110  (via drill 1.1 pad 1.93)
  other vias: 43.18,35.56
N$111  (via drill 1.1 pad 1.93)
  other vias: 43.18,38.1
N$112  (via drill 1.1 pad 1.93)
  other vias: 43.18,40.64
N$113  (via drill 1.1 pad 1.93)
  other vias: 40.64,40.64
N$114  (via drill 1.1 pad 1.93)
  other vias: 40.64,38.1
N$115  (via drill 1.1 pad 1.93)
  other vias: 40.64,35.56
N$116  (via drill 1.1 pad 1.93)
  other vias: 40.64,33.02
N$117  (via drill 1.1 pad 1.93)
  other vias: 38.1,33.02
N$118  (via drill 1.1 pad 1.93)
  other vias: 38.1,35.56
N$119  (via drill 1.1 pad 1.93)
  other vias: 38.1,38.1
N$120  (via drill 1.1 pad 1.93)
  other vias: 38.1,40.64
N$121  (via drill 1.1 pad 1.93)
  other vias: 35.56,40.64
N$122  (via drill 1.1 pad 1.93)
  other vias: 35.56,38.1
N$123  (via drill 1.1 pad 1.93)
  other vias: 35.56,35.56
N$124  (via drill 1.1 pad 1.93)
  other vias: 35.56,33.02
N$125  (via drill 1.1 pad 1.93)
  other vias: 33.02,33.02
N$126  (via drill 1.1 pad 1.93)
  other vias: 33.02,35.56
N$127  (via drill 1.1 pad 1.93)
  other vias: 33.02,38.1
N$128  (via drill 1.1 pad 1.93)
  other vias: 33.02,40.64
N$133
  Top 0.305: LED1.C 16.38,10.29 18.61,12.51 R4.2
N$135  (via drill 1.1 pad 1.93)
  other vias: 50.8,43.18
N$136  (via drill 1.1 pad 1.93)
  other vias: 53.34,43.18
N$137  (via drill 1.1 pad 1.93)
  other vias: 55.88,43.18
N$138  (via drill 1.1 pad 1.93)
  other vias: 58.42,43.18
N$141  (via drill 1.1 pad 1.93)
  other vias: 12.7,30.48
N$142  (via drill 1.1 pad 1.93)
  other vias: 15.24,30.48
N$143  (via drill 1.1 pad 1.93)
  other vias: 17.78,30.48
N$144  (via drill 1.1 pad 1.93)
  other vias: 22.86,30.48
N$145  (via drill 1.1 pad 1.93)
  other vias: 20.32,30.48
N$146  (via drill 1.1 pad 1.93)
  other vias: 25.4,30.48
N$147  (via drill 1.1 pad 1.93)
  other vias: 27.94,30.48
N$148  (via drill 1.1 pad 1.93)
  other vias: 30.48,30.48
N$149  (via drill 1.1 pad 1.93)
  other vias: 33.02,30.48
N$150  (via drill 1.1 pad 1.93)
  other vias: 35.56,30.48
N$151  (via drill 1.1 pad 1.93)
  other vias: 38.1,30.48
N$152  (via drill 1.1 pad 1.93)
  other vias: 40.64,30.48
N$153  (via drill 1.1 pad 1.93)
  other vias: 43.18,30.48
N$154  (via drill 1.1 pad 1.93)
  other vias: 45.72,30.48
N$155  (via drill 1.1 pad 1.93)
  other vias: 48.26,30.48
N$156  (via drill 1.1 pad 1.93)
  other vias: 50.8,30.48
N$157  (via drill 1.1 pad 1.93)
  other vias: 53.34,30.48
N$158  (via drill 1.1 pad 1.93)
  other vias: 55.88,30.48
N$159  (via drill 1.1 pad 1.93)
  other vias: 58.42,30.48
PWM0  (via drill 0.5)
  Top 0.305: JP1.1 60.71,35.31 60.71,30.61 59.05,28.96 47.5,28.96 v45.47,26.92 | U2.6 38.44,21.63 39.12,20.95 v39.12,20.07
  Bottom 0.305: v39.12,20.07 45.47,26.42 v45.47,26.92
PWM1  (via drill 0.5)
  Top 0.254: 61.34,30.23 61.34,33.53 62.48,34.67 62.48,36.58 JP1.2
  Top 0.305: U2.7 38.68,22.28 40.51,20.45 v40.51,19.81 | 61.34,30.23 58.8,27.69 47.62,27.69 v47.5,27.56
  Bottom 0.305: v40.51,19.81 40.51,20.7 47.37,27.56 v47.5,27.56
PWM2
  Top 0.305: U2.8 38.92,22.93 41.66,20.19 41.66,14.73 44.45,11.94 IC3.23
PWM3
  Top 0.305: U2.9 39.16,23.58 42.16,20.57 42.16,14.99 44.57,12.58 IC3.22
PWM4
  Top 0.305: U2.10 39.4,24.23 42.8,20.83 42.8,15.24 44.83,13.21 50.7,13.21 IC3.21
PWM5
  Top 0.305: U2.11 37.73,24.89 39.62,24.89 43.31,21.21 43.31,19.18 45.97,16.51 48.64,16.51 49.32,15.83 IC3.17
PWM6
  Top 0.305: U2.12 39.87,25.53 43.94,21.46 43.94,19.43 46.35,17.02 48.9,17.02 49.43,16.48 IC3.16
PWM7
  Top 0.305: U2.13 40.11,26.18 44.58,21.72 44.58,19.68 46.61,17.65 49.15,17.65 49.67,17.13 IC3.15
PWM8
  Top 0.305: IC1.23 21.09,25.91 21.97,26.8 31.85,26.8 U2.15
PWM9
  Top 0.305: IC1.22 21.45,25.26 22.35,26.16 31.86,26.16 U2.16
PWM10
  Top 0.305: U2.17 22.61,25.53 21.84,24.77 21.72,24.64 21.69,24.61 IC1.21
PWM11
  Top 0.305: IC1.17 19.98,22.01 20.57,22.61 26.54,22.61 28.82,24.88 U2.18
PWM12
  Top 0.305: IC1.16 20.09,21.36 20.83,22.1 27.05,22.1 29.18,24.23 U2.19
PWM13
  Top 0.305: IC1.15 20.33,20.71 21.21,21.59 27.43,21.59 29.42,23.58 U2.20
PWM14  (via drill 0.5)
  Top 0.254: U2.21 32.96,22.93 v33.53,23.5
  Bottom 0.254: v33.53,23.5 39.12,29.08 59.18,29.08 62.36,32.26 62.36,39.24 JP1.3
PWM15  (via drill 0.5)
  Top 0.254: v33.4,22.23 33.34,22.28 U2.22
  Bottom 0.254: JP1.4 62.87,41.27 62.87,32 59.31,28.45 40.13,28.45 33.91,22.23 v33.4,22.23
VCC  (via drill 0.5)
  Top 0.254: 23.38,23.75 23.43,23.75 C2.1 | v49.28,14.22 47.94,14.22 C3.1 | C10.1 48.51,10.29 48.64,10.16 v50.04,10.16 | R7.2 18.48,44.58 14.61,44.58 14.42,44.77 R8.2
  Top 0.305: 24.77,18.03 v23.11,18.03 | IC1.19 17.65,23.37 17.65,23.9 IC1.20 20.87,23.96 v21.08,23.75 23.38,23.75 | 24.77,18.41 24.77,19.05 | 24.77,19.05 24.77,20.07 C1.1 | 24.77,10.03 A0.1 A1.1 A2.1 A3.2 A4.2 | 28.57,18.8 25.02,18.8 24.77,19.05 | 28.57,18.8 28.7,18.92 28.7,20.7 29.46,21.46 30.48,21.46 30.96,20.98 U2.24 | U2.28 28.99,18.38 28.57,18.8 | 50.66,14.61 IC3.19 | IC3.20 IC3.19 | v49.28,14.22 50.42,14.22 IC3.19 | R8.2 10.81,45.72 v10.74,45.65 10.87,45.78 | C6.1 17.14,17.91 v16.76,18.29
  Top 0.406: 24.77,10.03 24.77,18.03 24.77,18.41 | SJ1.2 36.83,10.03 A0.1
  Top 0.61: 48.64,10.16 48.64,9.22 47.93,8.51 43.43,8.51 41.91,10.03 A0.1
  Bottom 0.305: 17.02,24 20.83,24 v21.08,23.75 | 17.02,24 16.76,23.75 v16.76,18.29 17.02,18.03 v23.11,18.03 | v49.28,14.22 49.28,10.92 v50.04,10.16 | 17.02,24 15.75,25.27 15.75,27.69 11.43,27.69 10.16,28.96 10.16,45.07 v10.74,45.65
VIN
  Bottom 1.016: PWR.2 23.11,7.87 45.09,7.87 45.59,7.37 45.59,6.1 JP2.1 U$1.VIN
VMOTOR
  Top 0.61: Q1.4 11.68,8.38 13.21,6.86 15.83,6.86 MPOWER.2

### Text on the board
tPlace: Servo 1 | Opt | Servo | Servo 2 | Servo pins | S1 | S2 | PWMs | #15 | Reset | #14 | #1 | #0 | M1 | Adafruit Motor Shield v2.3 | 2 steppers or | 4 DC motors | 1.2A per motor | (3A max) | GND | M4 | M2 | VIN | GND | Jumper | Power | logic: | 3v | 5v | 4 | 5 | M3 | + | - | 5-12V Motor | Power
bPlace: For opt. servo | pwr supply cut trace | Adafruit Motor Shield v2! / Control 4 DC Motors or / 2 Stepper motors via I2C / Pins used: SDA, SCL & / A4 tied to SDA, A5 to SCL